# Altium project 400AN_DigiME.PrjPcb
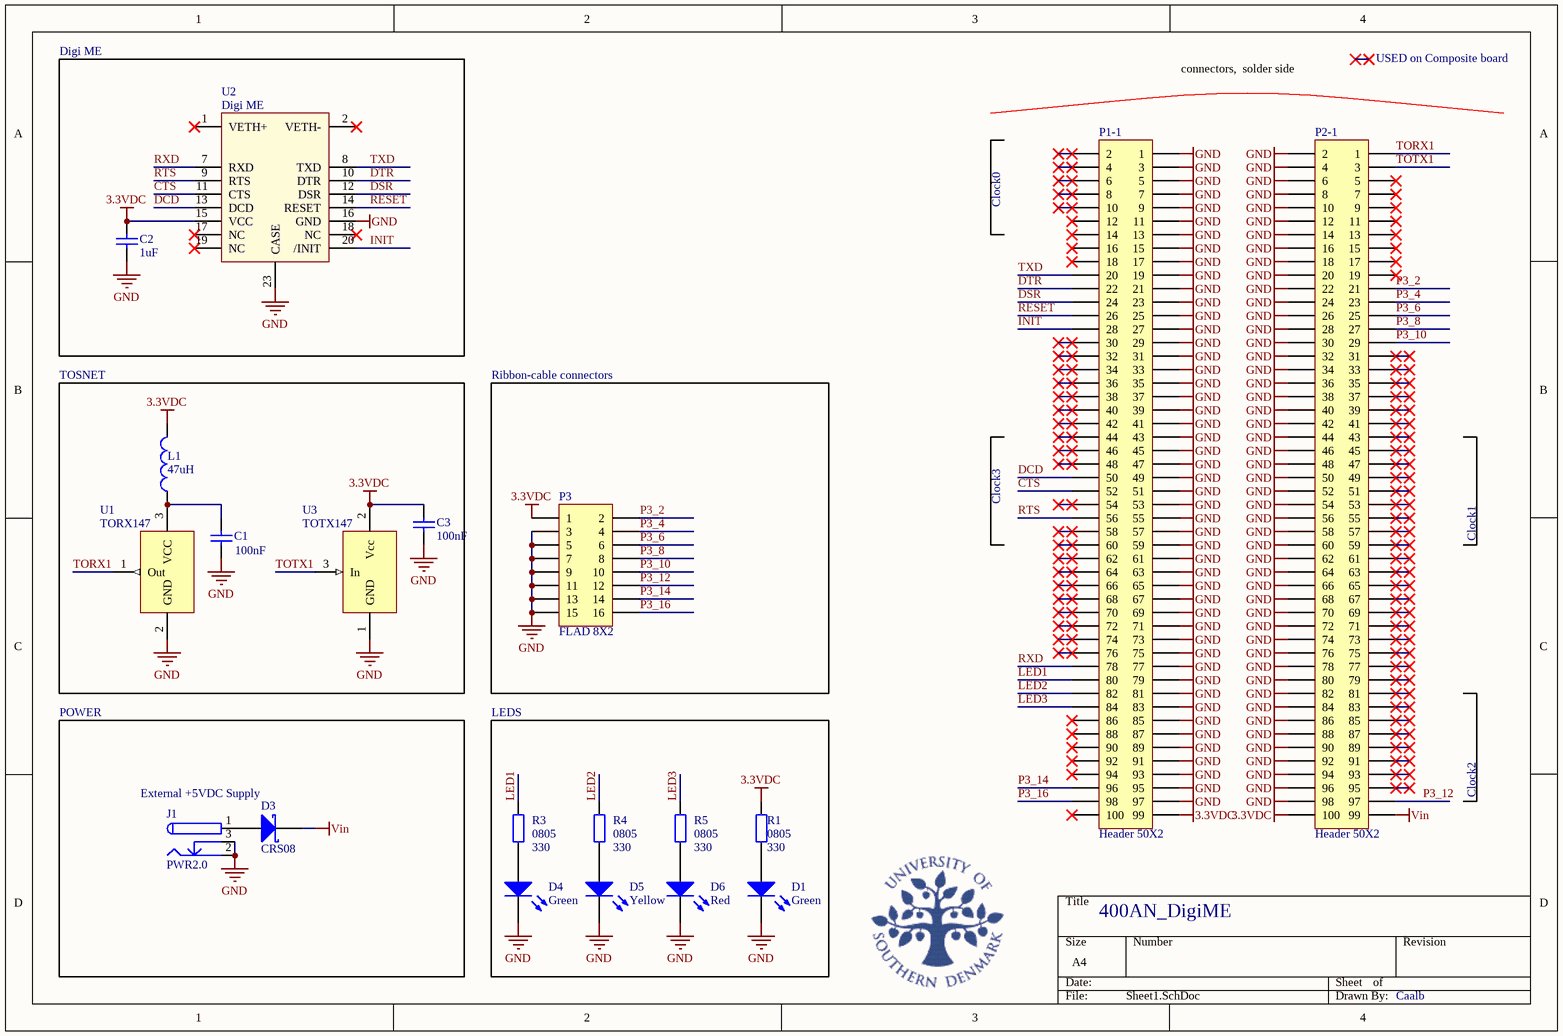
[diagram p0: Sheet1.SchDoc]
1 sheet, 20 parts. Net scope: global (net labels, ports and power ports of the same name join across sheets).
Board file: PCB1.PcbDoc

## Sheet Sheet1.SchDoc
size A4

### Parts
C1  value 100nF  [0603C]  (hidden comment: Cap)
C2  value 1uF  [0603C]  (hidden comment: Cap)
C3  value 100nF  [0603C]  (hidden comment: Cap)
D1  Green  [LED0805G]
D3  CRS08  [CRS08]
D4  Green  [LED0805G]
D5  Yellow  [LED0805Y]
D6  Red  [LED0805R]
J1  PWR2.0  [DC FATN Ø2.0]
L1  value 47uH  [1210C]  (hidden comment: Inductor)
P1-1  Header 50X2  [FX8C-100P-SV6(91)]
P2-1  Header 50X2  [FX8C-100P-SV6(91)]
P3  FLAD 8X2  [HDR2X8 FLAD]
R1  0805  value 330  [0805R]
R3  0805  value 330  [0805R]
R4  0805  value 330  [0805R]
R5  0805  value 330  [0805R]
U1  TORX147  [TOTX147]
U2  Digi ME  [Digi Connect ME]
U3  TOTX147  [TOTX147]

### Blocks framed on the sheet
Digi ME: C2 U2
TOSNET: C1 C3 L1 U1 U3
Ribbon-cable connectors: P3
LEDS: D1 D4-D6 R1 R3-R5

### Nets
3.3VDC: C2.1 C3.1 L1.2 P1-1.99 P2-1.100 P3.1 R1.1 U2.15(VCC) U3.2(Vcc)
GND: C1.1 C2.2 C3.2 D1.2(K) D4.2(K) D5.2(K) D6.2(K) J1.2 J1.3 P1-1.1 P1-1.3 P1-1.5 P1-1.7 P1-1.9 P1-1.11 P1-1.13 P1-1.15 P1-1.17 P1-1.19 P1-1.21 P1-1.23 P1-1.25 P1-1.27 P1-1.29 P1-1.31 P1-1.33 P1-1.35 P1-1.37 P1-1.39 P1-1.41 P1-1.43 P1-1.45 P1-1.47 P1-1.49 P1-1.51 P1-1.53 P1-1.55 P1-1.57 P1-1.59 P1-1.61 P1-1.63 P1-1.65 P1-1.67 P1-1.69 P1-1.71 P1-1.73 P1-1.75 P1-1.77 P1-1.79 P1-1.81 P1-1.83 P1-1.85 P1-1.87 P1-1.89 P1-1.91 P1-1.93 P1-1.95 P1-1.97 P2-1.2 P2-1.4 P2-1.6 P2-1.8 P2-1.10 P2-1.12 P2-1.14 P2-1.16 P2-1.18 P2-1.20 P2-1.22 P2-1.24 P2-1.26 P2-1.28 P2-1.30 P2-1.32 P2-1.34 P2-1.36 P2-1.38 P2-1.40 P2-1.42 P2-1.44 P2-1.46 P2-1.48 P2-1.50 P2-1.52 P2-1.54 P2-1.56 P2-1.58 P2-1.60 P2-1.62 P2-1.64 P2-1.66 P2-1.68 P2-1.70 P2-1.72 P2-1.74 P2-1.76 P2-1.78 P2-1.80 P2-1.82 P2-1.84 P2-1.86 P2-1.88 P2-1.90 P2-1.92 P2-1.94 P2-1.96 P2-1.98 P3.3 P3.5 P3.7 P3.9 P3.11 P3.13 P3.15 U1.2(GND) U2.16(GND) U2.23(CASE) U3.1(GND)
Vin: D3.2(K) P2-1.99
CTS: P1-1.52 U2.11(CTS)
DCD: P1-1.50 U2.13(DCD)
DSR: P1-1.24 U2.12(DSR)
DTR: P1-1.22 U2.10(DTR)
INIT: P1-1.28 U2.20(/INIT)
LED1: P1-1.80 R3.1
LED2: P1-1.82 R4.1
LED3: P1-1.84 R5.1
P3_2: P2-1.21 P3.2
P3_4: P2-1.23 P3.4
P3_6: P2-1.25 P3.6
P3_8: P2-1.27 P3.8
P3_10: P2-1.29 P3.10
P3_12: P2-1.97 P3.12
P3_14: P1-1.96 P3.14
P3_16: P1-1.98 P3.16
RESET: P1-1.26 U2.14(RESET)
RTS: P1-1.56 U2.9(RTS)
RXD: P1-1.78 U2.7(RXD)
TORX1: P2-1.1 U1.1(Out)
TOTX1: P2-1.3 U3.3(In)
TXD: P1-1.20 U2.8(TXD)
NetC1_2: C1.2 L1.1 U1.3(VCC)
NetD1_1: D1.1(A) R1.2
NetD3_1: D3.1(A) J1.1
NetD4_1: D4.1(A) R3.2
NetD5_1: D5.1(A) R4.2
NetD6_1: D6.1(A) R5.2

Not connected (* = marked no-connect by the designer): P1-1 2* 4* 6* 8* 10* 12* 14* 16* 18* 30* 32* 34* 36* 38* 40* 42* 44* 46* 48* 54* 58* 60* 62* 64* 66* 68* 70* 72* 74* 76* 86* 88* 90* 92* 94* 100*; P2-1 5* 7* 9* 11* 13* 15* 17* 19* 31* 33* 35* 37* 39* 41* 43* 45* 47* 49* 51* 53* 55* 57* 59* 61* 63* 65* 67* 69* 71* 73* 75* 77* 79* 81* 83* 85* 87* 89* 91* 93* 95*; U1 4(N/A) 5(N/A); U2 1(VETH+)* 2(VETH-)* 17(NC)* 18(NC)* 19(NC)*; U3 4(N/A) 5(N/A)

### Notes on the sheet
- connectors,  solder side
- USED on Composite board
- Clock0
- Clock3
- Clock1
- POWER
- Clock2
- External +5VDC Supply
- 400AN_DigiME
- Caalb

### Library data of the parts
C1-C3 = Cap: Capacitor; Published: 8-Jun-2000; LatestRevisionDate: 17-Jul-2002; LatestRevisionNote: Re-released for DXP Platform.; PackageReference: RAD-0.3; Publisher: Altium Limited
D1 D4-D6 = LED0: Published: 8-Jun-2000; LatestRevisionDate: 08-Jul-2005; LatestRevisionNote: Mech Layer 1 removed.; PackageReference: LED-0; Publisher: Altium Limited
D3 = Diode 11DQ03: Schottky Rectifier; Dist: Farnell: 1300796; Published: 8-Jun-2000; LatestRevisionDate: 17-Jul-2002; LatestRevisionNote: Re-released for DXP Platform.; DatasheetDocument: Dec-1997; PackageReference: DO-204AL; Publisher: Altium Limited; Code_JEDEC: DO-204-AL; ComponentLink1Description: Manufacturer Link; ComponentLink1URL: http://www.irf.com/; ComponentLink2Description: Datasheet; ComponentLink2URL: http://www.irf.com/product-info/datasheets/data/11dq03.pdf
J1 = PWR2.5: Low Voltage Power Supply Connector; Published: 17-Dec-2003; DatasheetDocument: 09-May-2002; Publisher: Altium Limited; ComponentLink1Description: Manufacturer Link; ComponentLink1URL: http://domino.kycon.com/internet/Products.html
L1 = Inductor: Code_IEC: 1005; Dist: Farnell: 145-7868; Published: 8-Jun-2000; LatestRevisionDate: 17-Jul-2002; LatestRevisionNote: Re-released for DXP Platform.; PackageReference: 0402-A; Publisher: Altium Limited; Code_JEITA: 0402
P1-1 P2-1 = Header 50X2: FX8C-100S-SV(91); LatestRevisionDate: 17-Jul-2002; LatestRevisionNote: Re-released for DXP Platform.; Publisher: Altium Limited
P3 = Header 8X2: Header, 8-Pin, Dual row; LatestRevisionDate: 17-Jul-2002; LatestRevisionNote: Re-released for DXP Platform.; Publisher: Altium Limited
R1 R3-R5 = Res2: Resistor; Published: 8-Jun-2000; LatestRevisionDate: 17-Jul-2002; LatestRevisionNote: Re-released for DXP Platform.; PackageReference: AXIAL-0.4; Publisher: Altium Limited
U1 = TORX147: Optic Receiving module; Dist: Farnell: 1225768
U2 = Digi ME: Digi One ME connector
U3 = TOTX147: Optic Transmitting module; Dist: Farnell: 1225773